# Altium schematic sheet LTE_auto_start_Rev01.SchDoc
size Letter; SheetNumber: 3; SheetTotal: 6
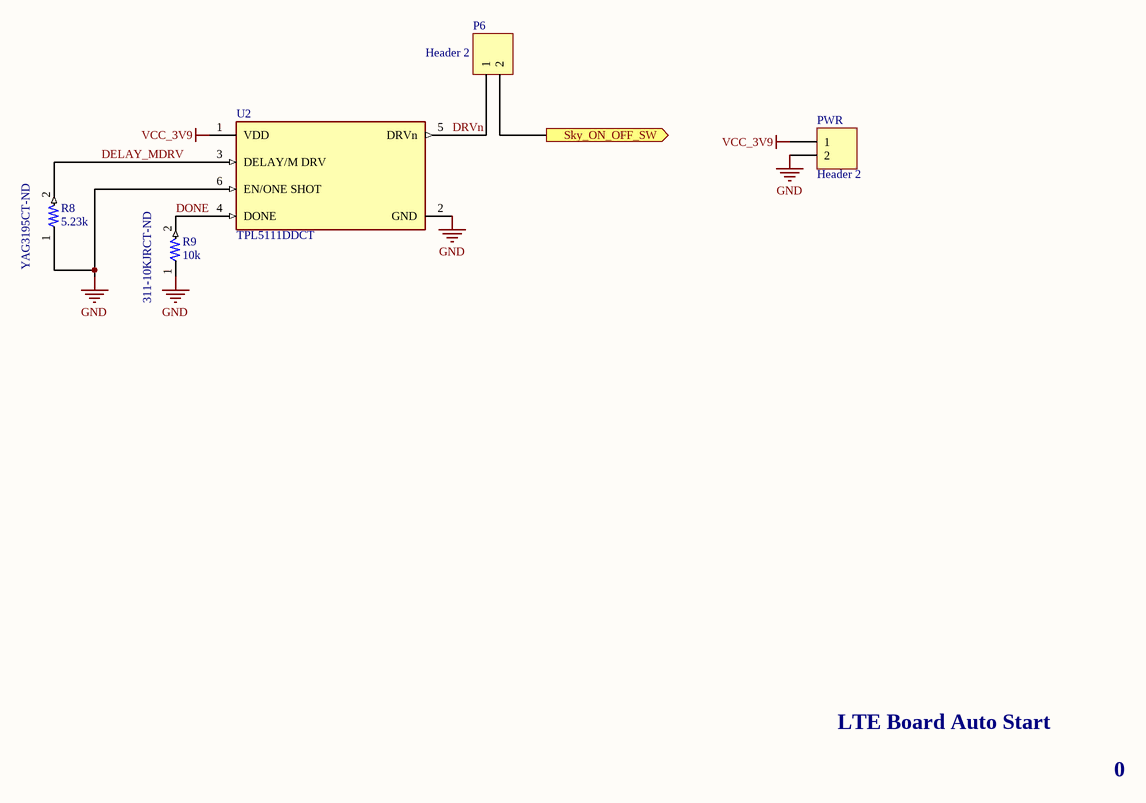
[diagram p0: LTE_auto_start_Rev01.SchDoc]

## Parts
P6  Header 2  [HDR1X2]
PWR  Header 2  [Wire_entry_200mil]
R8  Resistance_Ohms: 5.23k  [SMD RES 1005]  (hidden comment: YAG3195CT-ND)
R9  Part_Number: 311-10KJRCT-ND  Resistance_Ohms: 10k  [SMD RES 1005]  (hidden comment: RC0402JR-0710KL)
U2  TPL5111DDCT  [FP-DDC0006A-IPC_B]

## Ports
Sky_ON_OFF_SW (out, see LTE_block_diagram[3B], LTE_Adapter_Board_Rev02[5B])

## Nets
GND: PWR.2 R8.1 R9.1 U2.2(GND) U2.6(EN/ONE_SHOT)
VCC_3V9: PWR.1 U2.1(VDD)
DELAY_MDRV: R8.2 U2.3(DELAY/M_DRV)
DONE: R9.2 U2.4(DONE)
DRVn: P6.1 U2.5(DRVn)
Sky_ON_OFF_SW: P6.2 ; port Sky_ON_OFF_SW

## Notes on the sheet
- (near U2) 7.4.3 One-Shot Mode
  During one-shot mode (EN/ONE_SHOT = LOW), the TPL5111 generates just one pulse at the DRVn pin whichlasts according to the programmed time interval. In one-shot mode, other DRVn pulses can be triggered usingthe DELAY/M_DRV pin. If a valid manual power ON occurs when EN/ONE_SHOT is LOW, the TPL5111generates just one pulse at the DRVn pin. The duration of the pulse is set by the programmed time interval. Alsoin this case, if a DONE signal is received within the programmed time interval (minus 50 ms), the DRVn output isasserted LOW.
- 7.3.1 DRVn
  The DRVn pin may be connected to the enable input of an LDO or DC-DC converter. The pulse generated atDRVn is equal to the programmed time interval period (tIP), minus 50 ms. It is shorter if a DONE signal isreceived from the µC before tIP – 50 ms. If the DONE signal is not received within tIP – 50 ms, the DRVn signalwill be LOW for the last 50 ms of tIP before the next cycle starts.
  The default value (after resistance reading) is HIGH. The signal is sent out from the TPL5111 when theprogrammed time interval starts. When the DRVn is HIGH, the manual power ON signal is ignored.
- (near U2) 7.4.3 One-Shot Mode
  During one-shot mode (EN/ONE_SHOT = LOW), the TPL5111 generates just one pulse at the DRVn pin which
  lasts according to the programmed time interval. In one-shot mode, other DRVn pulses can be triggered using
  the DELAY/M_DRV pin. If a valid manual power ON occurs when EN/ONE_SHOT is LOW, the TPL5111
  generates just one pulse at the DRVn pin. The duration of the pulse is set by the programmed time interval. Also
  in this case, if a DONE signal is received within the programmed time interval (minus 50 ms), the DRVn output is
  asserted LOW.
  The TPL5111 can also work in a one-shot mode (EN/ONE_SHOT= LOW)
  The EN/ONE_SHOT pin must be hard wired to GND or VDD
  according to the required mode of operation.
- (near U2) 7.3.2 DONE
  The DONE pin is driven by a µC to signal that the µC is working properly. The TPL5111 recognizes a validDONE signal as a low to high transition. If two or more DONE signals are received within the time interval, onlythe first DONE signal is processed. The minimum DONE signal pulse length is 100 ns. When the TPL5111receives the DONE signal it asserts DRVn logic LOW.
- (near U2) 7.5.1 Configuring the Time Interval With the DELAY/M_DRV Pin
  The time interval between two adjacent DRVn pulses (rising edges, in timer mode) is selectable through anexternal resistance (REXT) between the DELAY/M_DRV pin and ground. The resistance (REXT) must be in therange between 500 Ω and 170 kΩ. At least a 1% precision resistance is recommended. See Selection of theExternal Resistance on how to set the time interval using REXT. During start-up, the external resistance is readimmediately after POR.
- LTE Board Auto Start
- 0

## Library data of the parts
P6 PWR = Header 2: Header, 2-Pin; LatestRevisionDate: 17-Jul-2002; LatestRevisionNote: Re-released for DXP Platform.; Publisher: Altium Limited
R8 = 1000794: 5.23 kOhms ±1% 0.063W, 1/16W Chip Resistor 0402 (1005 Metric) Moisture Resistant Thick Film; Manufacturer1: Bourns Inc; Manufacturer: YAGEO; Manufacturer Product Number: RC0402FR-075K23L; Item_Phase: Production; Mounting_Type: Surface Mount; Number_of_Terminations: 2; Operating_Temperature: -55°C ~ 155°C; Temperature_Coefficient: ±100ppm/°C; Resistance: 5.23k 1%; Part_Number: YAG3195CT-ND; Part_Type: Resistor; Revision: A; Composition: Thick Film; Features: Moisture Resistant; Height: 0.016" (0.40mm); Power: 0.063W, 1/16W; Resistor_Package: 0402 (1005 Metric); Size_Dimension: 0.039" L x 0.020" W (1.00mm x 0.50mm); Tolerance: ±1%; Digi-Key Part Number: YAG3195CT-ND
R9 = 1000794: 10 kOhms ±5% 0.063W, 1/16W Chip Resistor 0402 (1005 Metric) Moisture Resistant Thick Film; Manufacturer1: Bourns Inc; Manufacturer: YAGEO; Item_Phase: Production; Mounting_Type: Surface Mount; Number_of_Terminations: 2; Operating_Temperature: -55°C ~ 155°C; Temperature_Coefficient: ±100ppm/°C; Tolerance: ±1%; Part_Type: Resistor; Revision: A; Composition: Thick Film; Features: Moisture Resistant; Height: 0.016" (0.40mm); Power: 0.063W, 1/16W; Resistor_Package: 0402 (1005 Metric); Size_Dimension: 0.039" L x 0.020" W (1.00mm x 0.50mm); Digi-Key Part Number: 311-10KJRCT-ND; Manufacturer Product Number: RC0402JR-0710KL
U2 = CMP-04857-000005-1: IC OSC PROG TIMER TSOT23-6; Manufacturer: Texas Instruments; Quiescent Current: 35nA; Max Supply Voltage: 5.5V; Min Supply Voltage: 1.8V; RoHS Compliant: Yes; Case/Package: SOT-23-6; Mount: Surface Mount; Lead Free: Lead Free; REACH SVHC: No SVHC; Operating Supply Current: 35nA; Packaging: Cut Tape; Number of Pins: 6; Min Operating Temperature: -40°C; Max Operating Temperature: 105°C; Digi-Key Part Number: 296-42621-1-ND; Manufacturer Product Number: TPL5111DDCT; ComponentLink1Description: Datasheet; ComponentLink1URL: C:\Users\Roman.Chak\Documents\Projects\UVDI-360\Docs\Datasheets\TI\tpl5111.pdf; Value: IC